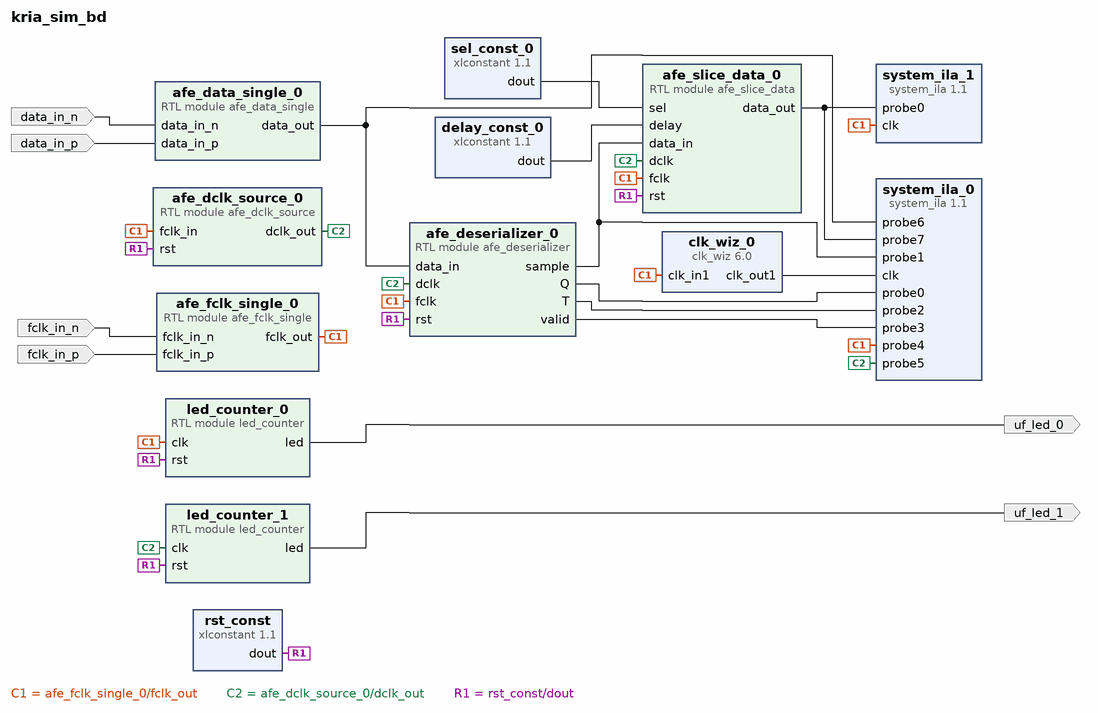
[diagram p0: block diagram of the top level]
# Vivado block design kria_sim_bd, xck26-sfvc784-2LV-c, Vivado 2022.2
create_bd_design kria_sim_bd

create_bd_port -dir I fclk_in_n
create_bd_port -dir I fclk_in_p
create_bd_port -dir I data_in_p
create_bd_port -dir I data_in_n
create_bd_port -dir O uf_led_0
create_bd_port -dir O uf_led_1

create_bd_cell -type module -reference afe_dclk_source afe_dclk_source_0
create_bd_cell -type ip -vlnv xilinx.com:ip:xlconstant:1.1 rst_const
set_property -dict {CONFIG.CONST_VAL 0} [get_bd_cells rst_const]
create_bd_cell -type ip -vlnv xilinx.com:ip:clk_wiz:6.0 clk_wiz_0
set_property -dict [list \
  CONFIG.CLKIN1_JITTER_PS 250.0 \
  CONFIG.CLKOUT1_JITTER 117.851 \
  CONFIG.CLKOUT1_PHASE_ERROR 166.453 \
  CONFIG.CLKOUT1_REQUESTED_OUT_FREQ 560 \
  CONFIG.MMCM_CLKFBOUT_MULT_F 29.750 \
  CONFIG.MMCM_CLKIN1_PERIOD 25.000 \
  CONFIG.MMCM_CLKIN2_PERIOD 10.0 \
  CONFIG.MMCM_CLKOUT0_DIVIDE_F 2.125 \
  CONFIG.PRIM_IN_FREQ 40 \
  CONFIG.RESET_PORT reset \
  CONFIG.RESET_TYPE ACTIVE_HIGH \
  CONFIG.USE_LOCKED false \
  CONFIG.USE_RESET false \
] [get_bd_cells clk_wiz_0]
create_bd_cell -type ip -vlnv xilinx.com:ip:system_ila:1.1 system_ila_0
set_property -dict [list \
  CONFIG.C_DATA_DEPTH 1024 \
  CONFIG.C_MON_TYPE NATIVE \
  CONFIG.C_NUM_OF_PROBES 8 \
  CONFIG.C_PROBE0_TYPE 0 \
  CONFIG.C_PROBE0_WIDTH 16 \
  CONFIG.C_PROBE1_TYPE 0 \
  CONFIG.C_PROBE1_WIDTH 32 \
  CONFIG.C_PROBE2_TYPE 0 \
  CONFIG.C_PROBE2_WIDTH 16 \
  CONFIG.C_PROBE3_TYPE 0 \
  CONFIG.C_PROBE3_WIDTH 1 \
  CONFIG.C_PROBE7_WIDTH 16 \
  CONFIG.C_PROBE_WIDTH_PROPAGATION MANUAL \
] [get_bd_cells system_ila_0]
create_bd_cell -type module -reference led_counter led_counter_0
create_bd_cell -type module -reference led_counter led_counter_1
create_bd_cell -type module -reference afe_deserializer afe_deserializer_0
create_bd_cell -type ip -vlnv xilinx.com:ip:xlconstant:1.1 delay_const_0
set_property -dict {CONFIG.CONST_VAL 1 CONFIG.CONST_WIDTH 4} [get_bd_cells delay_const_0]
create_bd_cell -type ip -vlnv xilinx.com:ip:xlconstant:1.1 sel_const_0
set_property -dict {CONFIG.CONST_VAL 2 CONFIG.CONST_WIDTH 4} [get_bd_cells sel_const_0]
create_bd_cell -type module -reference afe_slice_data afe_slice_data_0
create_bd_cell -type ip -vlnv xilinx.com:ip:system_ila:1.1 system_ila_1
set_property -dict {CONFIG.C_DATA_DEPTH 2048 CONFIG.C_MON_TYPE NATIVE CONFIG.C_NUM_OF_PROBES 1} [get_bd_cells system_ila_1]
create_bd_cell -type module -reference afe_fclk_single afe_fclk_single_0
create_bd_cell -type module -reference afe_data_single afe_data_single_0

# ---- connections ----

connect_bd_net -net Q [get_bd_pins afe_deserializer_0/Q] [get_bd_pins system_ila_0/probe0]
connect_bd_net -net T [get_bd_pins afe_deserializer_0/T] [get_bd_pins system_ila_0/probe2]
connect_bd_net -net afe_clk_data_input_0_data_out [get_bd_pins afe_data_single_0/data_out] \
  [get_bd_pins system_ila_0/probe6] [get_bd_pins afe_deserializer_0/data_in]
connect_bd_net -net afe_clk_data_input_0_fclk_out [get_bd_pins afe_fclk_single_0/fclk_out] \
  [get_bd_pins afe_dclk_source_0/fclk_in] [get_bd_pins clk_wiz_0/clk_in1] [get_bd_pins led_counter_0/clk] \
  [get_bd_pins system_ila_0/probe4] [get_bd_pins afe_deserializer_0/fclk] [get_bd_pins afe_slice_data_0/fclk] \
  [get_bd_pins system_ila_1/clk]
connect_bd_net [get_bd_pins afe_dclk_source_0/dclk_out] \
  [get_bd_pins led_counter_1/clk] [get_bd_pins system_ila_0/probe5] [get_bd_pins afe_deserializer_0/dclk] \
  [get_bd_pins afe_slice_data_0/dclk]
connect_bd_net [get_bd_pins afe_slice_data_0/data_out] [get_bd_pins system_ila_0/probe7] [get_bd_pins system_ila_1/probe0]
connect_bd_net [get_bd_pins clk_wiz_0/clk_out1] [get_bd_pins system_ila_0/clk]
connect_bd_net [get_bd_ports data_in_n] [get_bd_pins afe_data_single_0/data_in_n]
connect_bd_net [get_bd_ports data_in_p] [get_bd_pins afe_data_single_0/data_in_p]
connect_bd_net [get_bd_ports fclk_in_n] [get_bd_pins afe_fclk_single_0/fclk_in_n]
connect_bd_net [get_bd_ports fclk_in_p] [get_bd_pins afe_fclk_single_0/fclk_in_p]
connect_bd_net [get_bd_pins led_counter_0/led] [get_bd_ports uf_led_0]
connect_bd_net [get_bd_pins led_counter_1/led] [get_bd_ports uf_led_1]
connect_bd_net [get_bd_pins rst_const/dout] \
  [get_bd_pins afe_dclk_source_0/rst] [get_bd_pins led_counter_0/rst] [get_bd_pins led_counter_1/rst] \
  [get_bd_pins afe_deserializer_0/rst] [get_bd_pins afe_slice_data_0/rst]
connect_bd_net -net sample [get_bd_pins afe_deserializer_0/sample] [get_bd_pins system_ila_0/probe1] [get_bd_pins afe_slice_data_0/data_in]
connect_bd_net [get_bd_pins sel_const_0/dout] [get_bd_pins afe_slice_data_0/sel]
connect_bd_net -net valid [get_bd_pins afe_deserializer_0/valid] [get_bd_pins system_ila_0/probe3]
connect_bd_net -net xlconstant_0_dout [get_bd_pins delay_const_0/dout] [get_bd_pins afe_slice_data_0/delay]
set_property HDL_ATTRIBUTE.DEBUG true [get_bd_nets Q]
set_property HDL_ATTRIBUTE.MARK_DEBUG true [get_bd_nets Q]
set_property HDL_ATTRIBUTE.DEBUG true [get_bd_nets T]
set_property HDL_ATTRIBUTE.MARK_DEBUG true [get_bd_nets T]
set_property HDL_ATTRIBUTE.DEBUG true [get_bd_nets sample]
set_property HDL_ATTRIBUTE.MARK_DEBUG true [get_bd_nets sample]
set_property HDL_ATTRIBUTE.DEBUG true [get_bd_nets valid]
set_property HDL_ATTRIBUTE.MARK_DEBUG true [get_bd_nets valid]

validate_bd_design
save_bd_design
